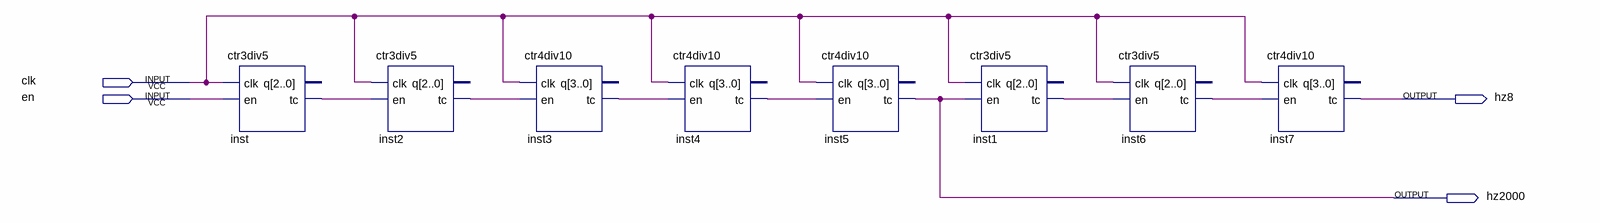
[diagram p0: schematic sheet]
// Quartus schematic timer_8hz.bdf as structural Verilog: 8 symbols, 4 pins
module timer_8hz (
  input  clk,
  input  en,
  output hz8,
  output hz2000
);

  wire inst1_tc, inst2_tc, inst3_tc, inst4_tc, inst6_tc, inst_tc;

  ctr3div5 inst (.clk(clk), .en(en), .tc(inst_tc));  // open: q
  ctr3div5 inst2 (.clk(clk), .en(inst_tc), .tc(inst2_tc));  // open: q
  ctr4div10 inst3 (.clk(clk), .en(inst2_tc), .tc(inst3_tc));  // open: q
  ctr4div10 inst4 (.clk(clk), .en(inst3_tc), .tc(inst4_tc));  // open: q
  ctr4div10 inst5 (.clk(clk), .en(inst4_tc), .tc(hz2000));  // open: q
  ctr3div5 inst1 (.clk(clk), .en(hz2000), .tc(inst1_tc));  // open: q
  ctr3div5 inst6 (.clk(clk), .en(inst1_tc), .tc(inst6_tc));  // open: q
  ctr4div10 inst7 (.clk(clk), .en(inst6_tc), .tc(hz8));  // open: q
endmodule
